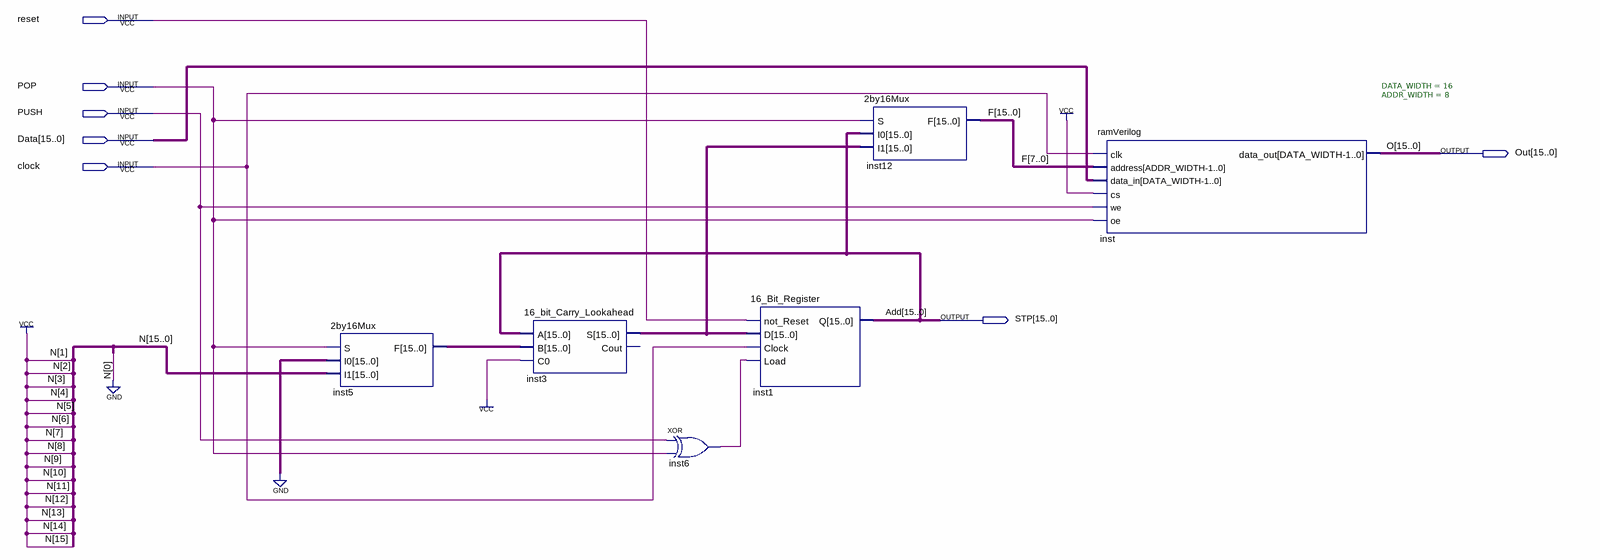
[diagram p0: schematic sheet]
// Quartus schematic Stack.bdf as structural Verilog: 6 symbols, 7 pins
module Stack (
  input  reset,
  input  POP,
  input  PUSH,
  input  [15:0] Data,
  input  clock,
  output [15:0] Out,
  output [15:0] STP
);

  wire inst6_out;
  wire [15:0] F, inst3_s, inst5_f;

  \2by16Mux  inst5 (.S(POP), .I0({16{1'b0}}), .I1(16'b1111111111111110), .F(inst5_f));
  \16_bit_Carry_Lookahead  inst3 (.A(STP), .B(inst5_f), .C0(1'b1), .S(inst3_s));  // open: Cout
  xor inst6 (inst6_out, PUSH, POP);
  \16_Bit_Register  inst1 (.not_Reset(reset), .D(inst3_s), .Clock(clock), .Load(inst6_out), .Q(STP));
  \2by16Mux  inst12 (.S(POP), .I0(STP), .I1(inst3_s), .F(F));
  ramVerilog #(.DATA_WIDTH(16), .ADDR_WIDTH(8)) inst (
    .clk(clock), .address(F[7:0]), .data_in(Data), .cs(1'b1), .we(PUSH), .oe(POP), .data_out(Out));

  // Other names for the same wires on the sheet: Add[15:0] = STP; O[15:0] = Out
endmodule
